# Altium schematic sheet Pi3-GPS-Neo6M.SchDoc
size A
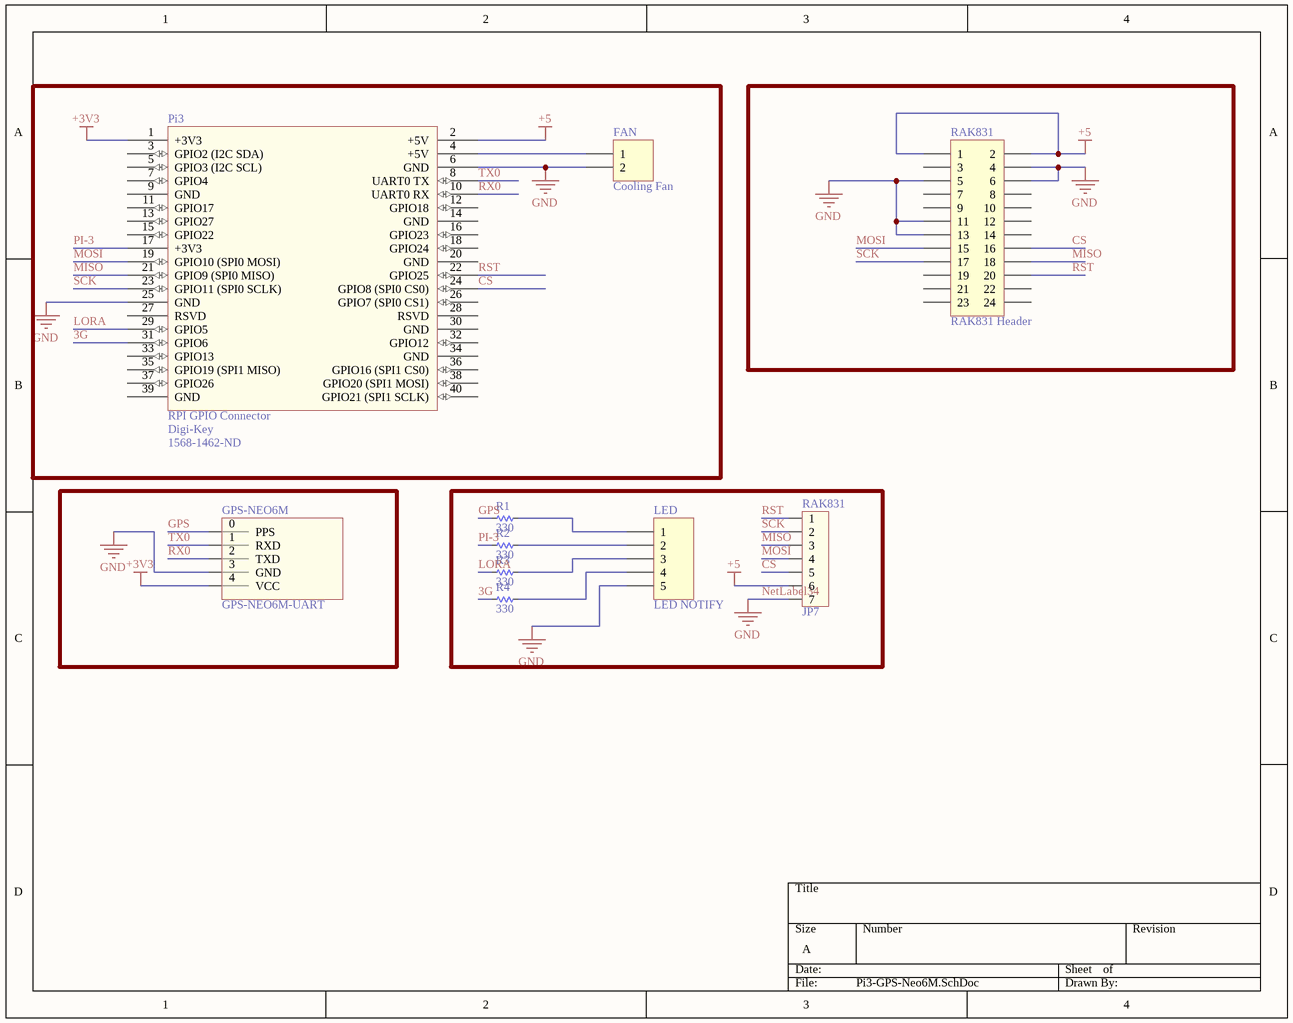
[diagram p0: Pi3-GPS-Neo6M.SchDoc]

## Parts
(Parts that share a designator on the sheet are numbered #1, #2 ... from top to bottom, then left to right.)
FAN  Cooling Fan  [HDR1X2H]
GPS-NEO6M  GPS-NEO6M-UART  [GPS-NEO6M-UART]
LED  LED NOTIFY  [HDR1X5]
Pi3  RPI GPIO Connector  Supplier 1: Digi-Key  Supplier Part Number 1: 1568-1462-ND  [rpi]
R1  330  [RES-SMD-0805]
R2  330  [RES-SMD-0805]
R3  330  [RES-SMD-0805]
R4  330  [RES-SMD-0805]
RAK831#1  RAK831 Header  [HDR2X12]
RAK831#2  JP7  [Header7]

## Nets
+3V3: GPS-NEO6M.4(VCC) Pi3.1(+3V3)
+5: Pi3.2(+5V) RAK831#1.1 RAK831#1.2 RAK831#2.6
NetLabel34: FAN.2 GPS-NEO6M.3(GND) LED.5 Pi3.6(GND) Pi3.25(GND) RAK831#1.4 RAK831#1.5 RAK831#1.6 RAK831#1.11 RAK831#1.13 RAK831#2.7  [also labelled GND]
3G: Pi3.31(GPIO6) R4.2
CS: Pi3.24(GPIO8_(SPI0_CS0)) RAK831#1.16 RAK831#2.5
GPS: GPS-NEO6M.0(PPS) R1.2
LORA: Pi3.29(GPIO5) R3.2
MISO: Pi3.21(GPIO9_(SPI0_MISO)) RAK831#1.18 RAK831#2.3
MOSI: Pi3.19(GPIO10_(SPI0_MOSI)) RAK831#1.15 RAK831#2.4
PI-3: Pi3.17(+3V3) R2.2
RST: Pi3.22(GPIO25) RAK831#1.20 RAK831#2.1
RX0: GPS-NEO6M.2(TXD) Pi3.10(UART0_RX)
SCK: Pi3.23(GPIO11_(SPI0_SCLK)) RAK831#1.17 RAK831#2.2
TX0: GPS-NEO6M.1(RXD) Pi3.8(UART0_TX)
NetFAN_1: FAN.1 Pi3.4(+5V)
NetLED_1: LED.1 R1.1
NetLED_2: LED.2 R2.1
NetLED_3: LED.3 R3.1
NetLED_4: LED.4 R4.1

Not connected (* = marked no-connect by the designer): Pi3 3(GPIO2_(I2C_SDA)) 5(GPIO3_(I2C_SCL)) 7(GPIO4) 9(GND) 11(GPIO17) 12(GPIO18) 13(GPIO27) 14(GND) 15(GPIO22) 16(GPIO23) 18(GPIO24) 20(GND) 26(GPIO7_(SPI0_CS1)) 27(RSVD) 28(RSVD) 30(GND) 32(GPIO12) 33(GPIO13) 34(GND) 35(GPIO19_(SPI1_MISO)) 36(GPIO16_(SPI1_CS0)) 37(GPIO26) 38(GPIO20_(SPI1_MOSI)) 39(GND) 40(GPIO21_(SPI1_SCLK)); RAK831#1 3 7 8 9 10 12 14 19 21 22 23 24

## Library data of the parts
FAN = Header 2H: Header, 2-Pin, Right Angle; LatestRevisionDate: 17-Jul-2002; LatestRevisionNote: Re-released for DXP Platform.; Publisher: Altium Limited
LED = Header 5: Header, 5-Pin; LatestRevisionDate: 17-Jul-2002; LatestRevisionNote: Re-released for DXP Platform.; Publisher: Altium Limited
Pi3 = rpi connector: GPIO Header for Raspberry Pi A+/B+/Pi 2/Pi 3 - 2x20; Manufacturer: SparkFun Electronics; Manufacturer Part Number: PRT-14017; Nils Minor: author; nilsminor@web.de: mail; RoHS: RoHS Compliant; Category: Development Boards, Kits, Programmers; Stock 1: 150; Pricing 1: 1=1.84 (EUR); Part Status: Active; Accessory Type: Connector; For Use With/Related Products: Raspberry Pi; ComponentLink1URL: https://cdn.sparkfun.com/datasheets/Dev/RaspberryPi/12313.pdf; ComponentLink1Description: https://cdn.sparkfun.com/datasheets/Dev/RaspberryPi/12313.pdf
R1-R4 = Res-SMD: Resistor; Manufacturer: Generic Components; Class: Passive; Published: 08/06/2000; Publisher: Altium Hobart Technology Centre
RAK831#1 = Header 12X2: Header, 12-Pin, Dual row; LatestRevisionDate: 17-Jul-2002; LatestRevisionNote: Re-released for DXP Platform.; Publisher: Altium Limited
RAK831#2 = Header7: Connector 7; Value: Connector 7